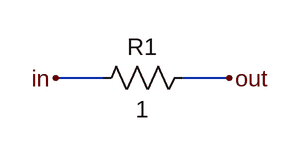
[diagram p0: schematic connect.asc]
connect.asc, the LTspice schematic file:
Version 4
SHEET 1 880 680
WIRE 240 128 192 128
WIRE 368 128 320 128
FLAG 192 128 in
FLAG 368 128 out
SYMBOL res 336 112 R90
WINDOW 0 0 56 VBottom 2
WINDOW 3 32 56 VTop 2
SYMATTR InstName R1
SYMATTR Value 1

The netlist it stands for:
* connect.asc
R1 out in 1
.backanno
.end